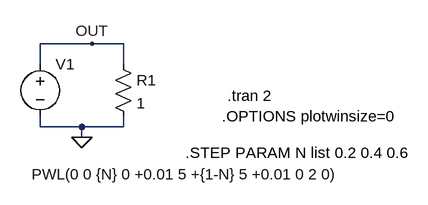
[diagram p0: schematic Fig_2-47_V-source-PWL-3.asc]
Fig_2-47_V-source-PWL-3.asc, the LTspice schematic file:
Version 4
SHEET 1 1120 680
WIRE -320 176 -400 176
WIRE -272 176 -320 176
WIRE -400 208 -400 176
WIRE -272 208 -272 176
WIRE -400 304 -400 288
WIRE -336 304 -400 304
WIRE -272 304 -272 288
WIRE -272 304 -336 304
WIRE -336 320 -336 304
FLAG -336 320 0
FLAG -320 176 OUT
SYMBOL res -288 192 R0
SYMATTR InstName R1
SYMATTR Value 1
SYMBOL voltage -400 192 R0
WINDOW 3 -13 185 Left 2
WINDOW 123 0 0 Left 0
WINDOW 39 0 0 Left 0
SYMATTR Value PWL(0 0 {N} 0 +0.01 5 +{1-N} 5 +0.01 0 2 0)
SYMATTR InstName V1
TEXT -112 256 Left 2 !.tran 2
TEXT -120 288 Left 2 !.OPTIONS plotwinsize=0
TEXT -176 344 Left 2 !.STEP PARAM N list 0.2 0.4 0.6

The netlist it stands for:
* Fig_2-47_V-source-PWL-3.asc
R1 OUT 0 1
V1 OUT 0 PWL(0 0 {N} 0 +0.01 5 +{1-N} 5 +0.01 0 2 0)
.tran 2
.OPTIONS plotwinsize=0
.STEP PARAM N list 0.2 0.4 0.6
.backanno
.end